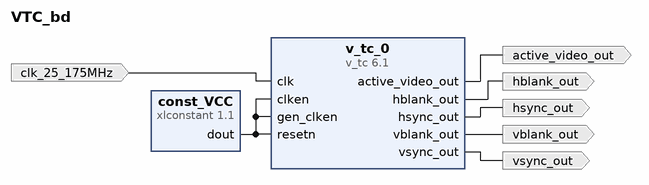
[diagram p0: block diagram of the top level]
# Vivado block design VTC_bd, xc7z020clg484-1, Vivado 2019.1
create_bd_design VTC_bd

create_bd_port -dir O active_video_out
create_bd_port -dir I -type clk clk_25_175MHz
set_property -dict {CONFIG.FREQ_HZ 74250000} [get_bd_ports clk_25_175MHz]
create_bd_port -dir O hblank_out
create_bd_port -dir O hsync_out
create_bd_port -dir O vblank_out
create_bd_port -dir O vsync_out

create_bd_cell -type ip -vlnv xilinx.com:ip:xlconstant:1.1 const_VCC
create_bd_cell -type ip -vlnv xilinx.com:ip:v_tc:6.1 v_tc_0
set_property -dict [list \
  CONFIG.HAS_AXI4_LITE false \
  CONFIG.HAS_INTC_IF false \
  CONFIG.SYNC_EN false \
  CONFIG.VIDEO_MODE 640x480p \
  CONFIG.enable_detection false \
  CONFIG.enable_generation true \
  CONFIG.horizontal_blank_generation true \
  CONFIG.vertical_blank_generation true \
] [get_bd_cells v_tc_0]

# ---- connections ----

connect_bd_net -net clk_0_1 [get_bd_ports clk_25_175MHz] [get_bd_pins v_tc_0/clk]
connect_bd_net [get_bd_pins v_tc_0/active_video_out] [get_bd_ports active_video_out]
connect_bd_net [get_bd_pins v_tc_0/hblank_out] [get_bd_ports hblank_out]
connect_bd_net [get_bd_pins v_tc_0/hsync_out] [get_bd_ports hsync_out]
connect_bd_net [get_bd_pins v_tc_0/vblank_out] [get_bd_ports vblank_out]
connect_bd_net [get_bd_pins v_tc_0/vsync_out] [get_bd_ports vsync_out]
connect_bd_net -net xlconstant_0_dout [get_bd_pins const_VCC/dout] \
  [get_bd_pins v_tc_0/clken] [get_bd_pins v_tc_0/gen_clken] [get_bd_pins v_tc_0/resetn]

validate_bd_design
save_bd_design
